# Altium project Hard_PCB_dsPIC.PrjPcb
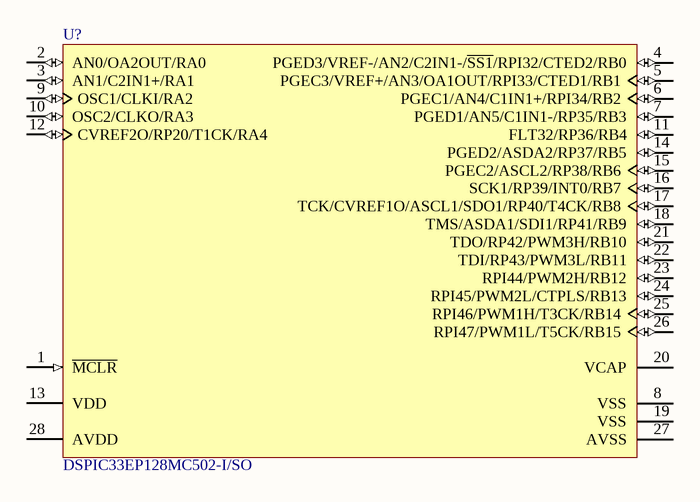
[diagram p0: Sheet1.SchDoc]
1 sheet, 1 parts. Net scope: global (net labels, ports and power ports of the same name join across sheets).
Board file: PCB1.PcbDoc

## Sheet Sheet1.SchDoc
size A4

### Parts
U?  DSPIC33EP128MC502-I/SO  [MCHP-SOIC-SO28_N]

### Nets

Not connected (* = marked no-connect by the designer): U? 1(~{MCLR}) 2(AN0/OA2OUT/RA0) 3(AN1/C2IN1+/RA1) 4(PGED3/VREF-/AN2/C2IN1-/~{SS1}/RPI32/CTED2/RB0) 5(PGEC3/VREF+/AN3/OA1OUT/RPI33/CTED1/RB1) 6(PGEC1/AN4/C1IN1+/RPI34/RB2) 7(PGED1/AN5/C1IN1-/RP35/RB3) 8(VSS) 9(OSC1/CLKI/RA2) 10(OSC2/CLKO/RA3) 11(FLT32/RP36/RB4) 12(CVREF2O/RP20/T1CK/RA4) 13(VDD) 14(PGED2/ASDA2/RP37/RB5) 15(PGEC2/ASCL2/RP38/RB6) 16(SCK1/RP39/INT0/RB7) 17(TCK/CVREF1O/ASCL1/SDO1/RP40/T4CK/RB8) 18(TMS/ASDA1/SDI1/RP41/RB9) 19(VSS) 20(VCAP) 21(TDO/RP42/PWM3H/RB10) 22(TDI/RP43/PWM3L/RB11) 23(RPI44/PWM2H/RB12) 24(RPI45/PWM2L/CTPLS/RB13) 25(RPI46/PWM1H/T3CK/RB14) 26(RPI47/PWM1L/T5CK/RB15) 27(AVSS) 28(AVDD)

### Library data of the parts
U? = DSPIC33EP128MC502-I/SO: 16-Bit Microcontroller and Digital Signal Controller with High-Speed PWM, Op Amps and Advanced Analog, 70 MIPS, 21 I/O, GPIO, -40 to 85 degC, 28-pin SOIC (SO28), Tube; Manufacturer: Microchip; DatasheetVersion: Rev. F; PackageVersion: C04-052C; PackageReference: SOIC-SO28; PackageDescription: 28-Lead Plastic Small Outline, 17.9 x 7.5 mm Body, 1.27 mm Pitch; Supplier 1: Digi-Key; Supplier Part Number 1: DSPIC33EP128MC502-I/SO-ND; Supplier 2: Farnell; Supplier Part Number 2: 2284909; Supplier 3: Newark; Supplier Part Number 3: 72T9227; Supplier 4: Newark; Supplier Part Number 4: 62W6046; Supplier 5: Mouser; Supplier Part Number 5: 579-33EP128MC502ISO; Mounting Technology: Surface Mount; PartNumber: DSPIC33EP128MC502-I/SO; ComponentLink1Description: Manufacturer URL; ComponentLink1URL: http://www.microchip.com; ComponentLink2Description: Datasheet; ComponentLink2URL: http://ww1.microchip.com/downloads/en/DeviceDoc/70657F.pdf; ComponentLink3Description: Package Specification; ComponentLink3URL: http://www.microchip.com/stellent/groups/techpub_sg/documents/packagingspec/en012702.pdf; ComponentLink4Description: Product URL; ComponentLink4URL: http://www.microchip.com/dsPIC33EP128MC502